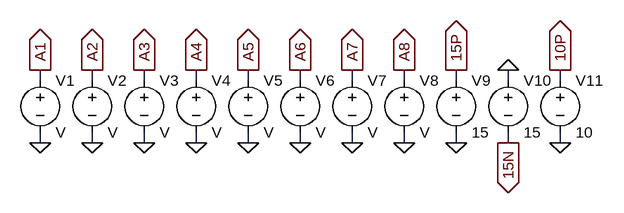
[diagram p0: schematic FONTES.asc]
FONTES.asc, the LTspice schematic file:
Version 4.1
SHEET 1 888 680
WIRE -160 160 -160 144
WIRE -80 160 -80 144
WIRE 0 160 0 144
WIRE 80 160 80 144
WIRE 160 160 160 144
WIRE 240 160 240 144
WIRE 320 160 320 144
WIRE 400 160 400 144
WIRE 480 160 480 144
WIRE 560 160 560 144
WIRE 640 160 640 144
WIRE -160 256 -160 240
WIRE -80 256 -80 240
WIRE 0 256 0 240
WIRE 80 256 80 240
WIRE 160 256 160 240
WIRE 240 256 240 240
WIRE 320 256 320 240
WIRE 400 256 400 240
WIRE 480 256 480 240
WIRE 560 256 560 240
WIRE 640 256 640 240
FLAG -160 256 0
FLAG -80 256 0
FLAG 0 256 0
FLAG 80 256 0
FLAG 160 256 0
FLAG 240 256 0
FLAG 320 256 0
FLAG 400 256 0
FLAG -160 144 A1
IOPIN -160 144 Out
FLAG -80 144 A2
IOPIN -80 144 Out
FLAG 0 144 A3
IOPIN 0 144 Out
FLAG 80 144 A4
IOPIN 80 144 Out
FLAG 160 144 A5
IOPIN 160 144 Out
FLAG 240 144 A6
IOPIN 240 144 Out
FLAG 320 144 A7
IOPIN 320 144 Out
FLAG 400 144 A8
IOPIN 400 144 Out
FLAG 560 144 0
FLAG 480 256 0
FLAG 480 144 15P
IOPIN 480 144 Out
FLAG 560 256 15N
IOPIN 560 256 Out
FLAG 640 256 0
FLAG 640 144 10P
IOPIN 640 144 Out
SYMBOL voltage -160 144 R0
SYMATTR InstName V1
SYMBOL voltage -80 144 R0
SYMATTR InstName V2
SYMBOL voltage 0 144 R0
SYMATTR InstName V3
SYMBOL voltage 80 144 R0
SYMATTR InstName V4
SYMBOL voltage 160 144 R0
SYMATTR InstName V5
SYMBOL voltage 240 144 R0
SYMATTR InstName V6
SYMBOL voltage 320 144 R0
SYMATTR InstName V7
SYMBOL voltage 400 144 R0
SYMATTR InstName V8
SYMBOL voltage 480 144 R0
WINDOW 123 0 0 Left 0
WINDOW 39 0 0 Left 0
SYMATTR InstName V9
SYMATTR Value 15
SYMBOL voltage 560 144 R0
WINDOW 123 0 0 Left 0
WINDOW 39 0 0 Left 0
SYMATTR InstName V10
SYMATTR Value 15
SYMBOL voltage 640 144 R0
WINDOW 123 0 0 Left 0
WINDOW 39 0 0 Left 0
SYMATTR InstName V11
SYMATTR Value 10

The netlist it stands for:
* FONTES.asc
V1 A1 0 V
V2 A2 0 V
V3 A3 0 V
V4 A4 0 V
V5 A5 0 V
V6 A6 0 V
V7 A7 0 V
V8 A8 0 V
V9 15P 0 15
V10 0 15N 15
V11 10P 0 10
.backanno
.end